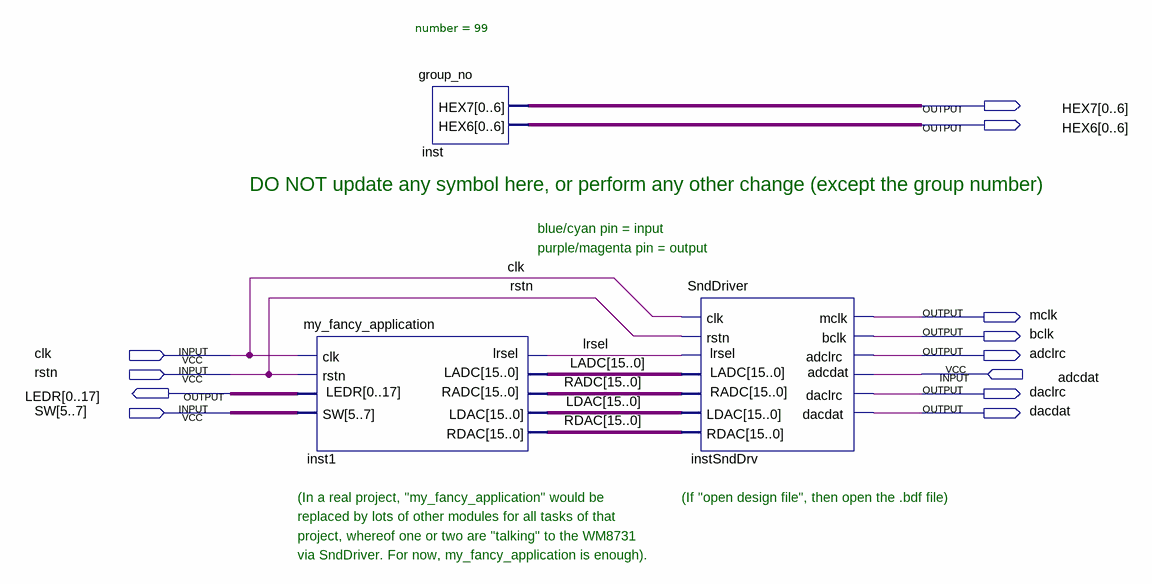
[diagram p0: schematic sheet]
// Quartus schematic Sound.bdf as structural Verilog: 3 symbols, 12 pins
module Sound (
  input  clk,
  input  rstn,
  input  adcdat,
  input  [5:7] SW,
  output [0:6] HEX7,
  output [0:6] HEX6,
  output mclk,
  output bclk,
  output adclrc,
  output [0:17] LEDR,
  output daclrc,
  output dacdat
);

  wire lrsel;
  wire [15:0] LADC, LDAC, RADC, RDAC;

  my_fancy_application inst1 (
    .clk(clk), .rstn(rstn), .SW(SW), .lrsel(lrsel), .LADC(LADC), .RADC(RADC), .LEDR(LEDR), .LDAC(LDAC),
    .RDAC(RDAC));
  group_no #(.number(99)) inst (.HEX7(HEX7), .HEX6(HEX6));
  SndDriver instSndDrv (
    .clk(clk), .rstn(rstn), .LDAC(LDAC), .adcdat(adcdat), .RDAC(RDAC), .mclk(mclk), .bclk(bclk),
    .adclrc(adclrc), .daclrc(daclrc), .lrsel(lrsel), .LADC(LADC), .dacdat(dacdat), .RADC(RADC));

  // Notes on the sheet:
  //   DO NOT update any symbol here, or perform any other change (except the group number)
  //   blue/cyan pin = input
  //   purple/magenta pin = output
  //   (In a real project, "my_fancy_application" would be
  //   (If "open design file", then open the .bdf file)
  //   replaced by lots of other modules for all tasks of that
  //   project, whereof one or two are "talking" to the WM8731
  //   via SndDriver. For now, my_fancy_application is enough).
endmodule
